# EAGLE design motor_driver_irf7413 (EAGLE 6.5.0)
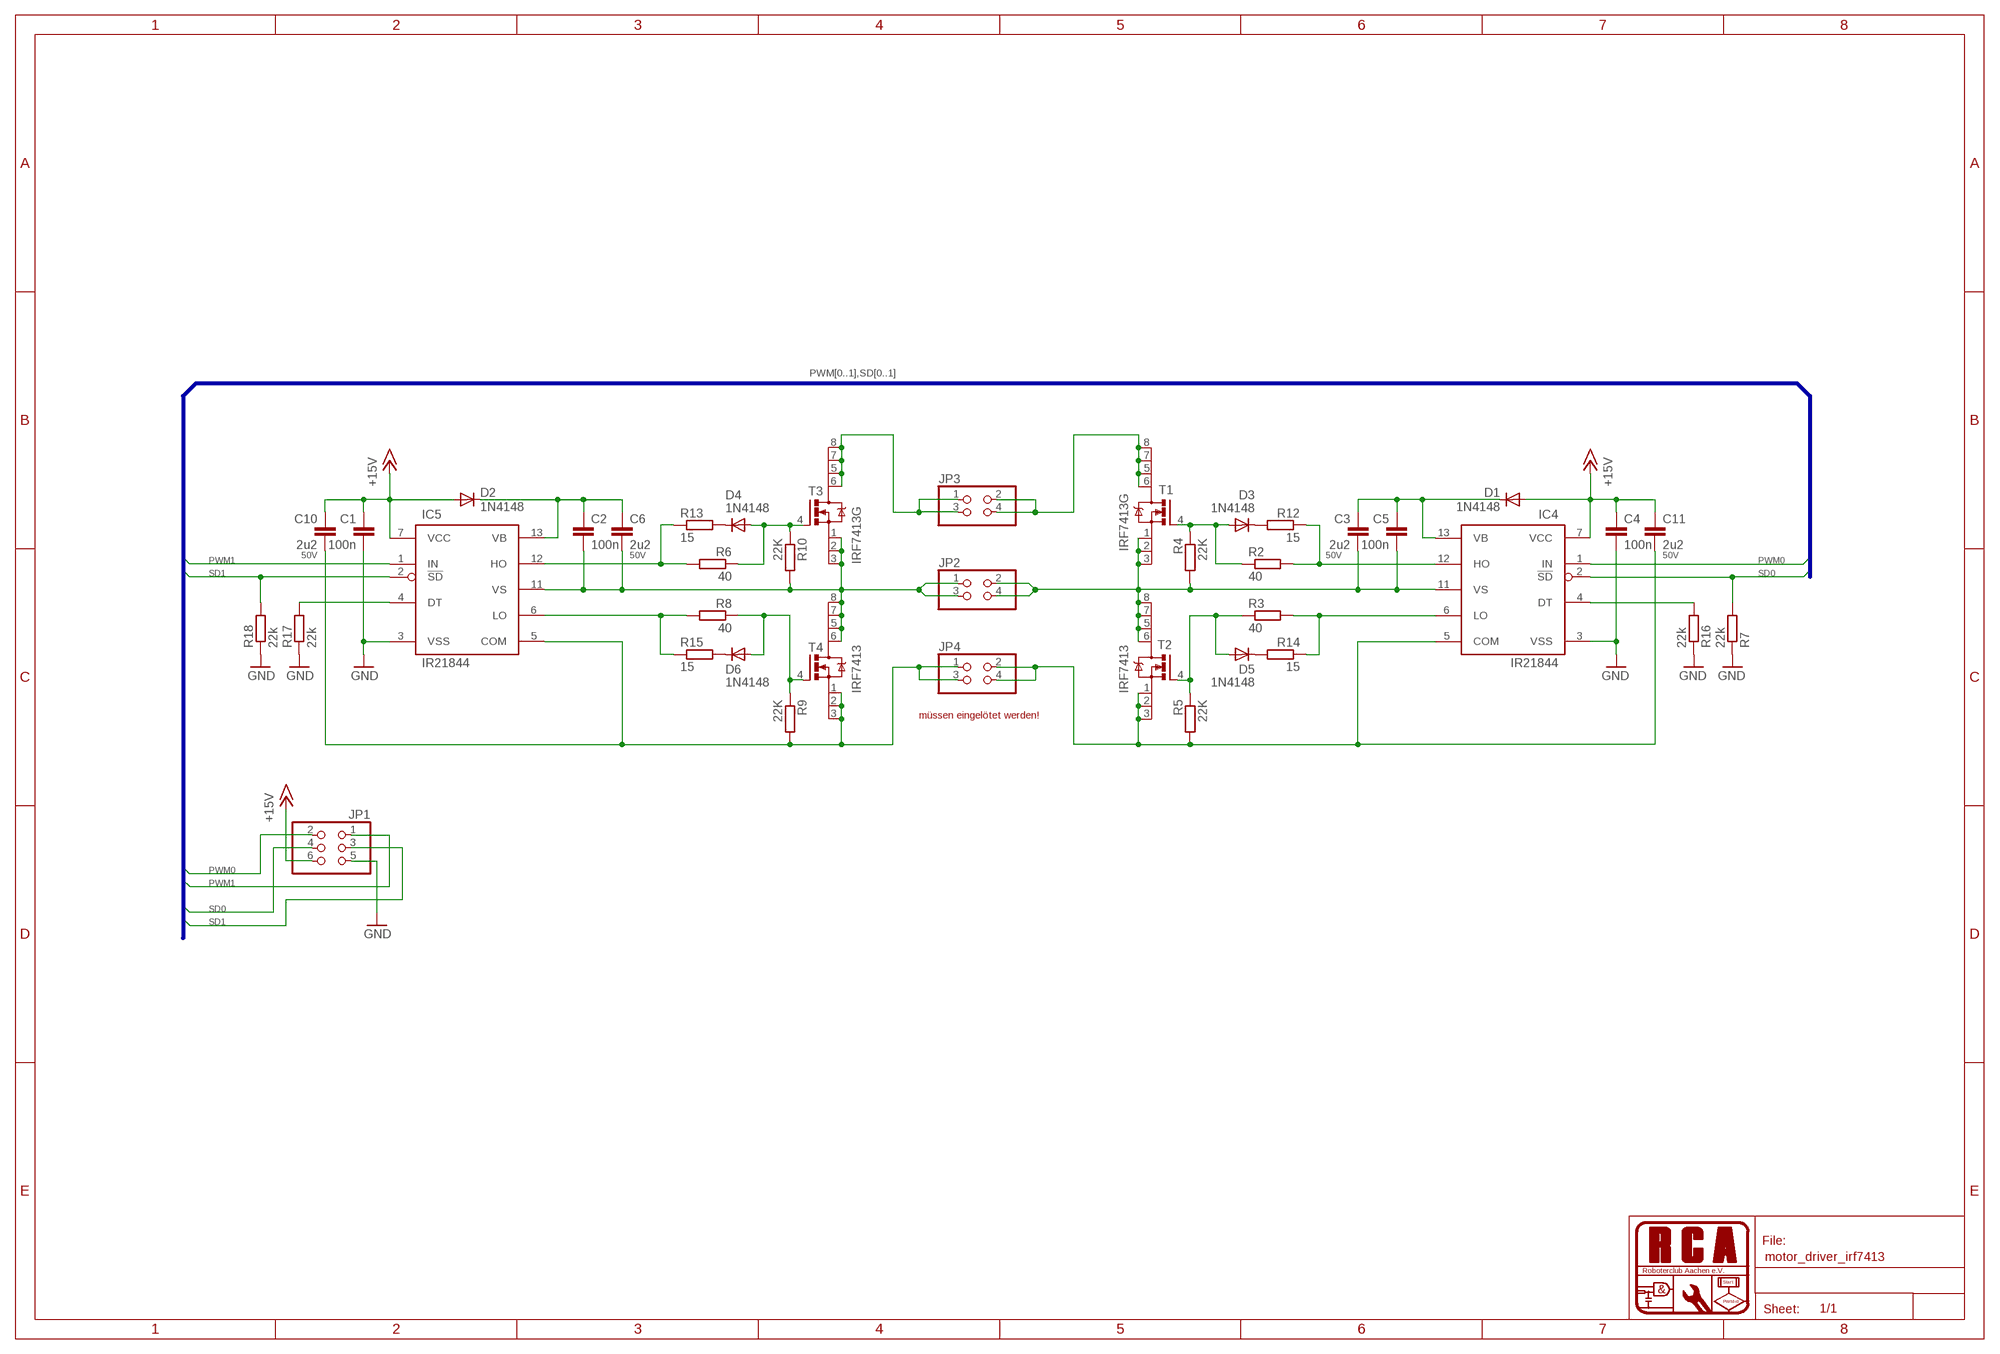
[diagram p0: schematic, sheet 1]

## Parts
C1  100n  C-EUC0805  [C0805]
C2  100n  C-EUC1206  [C1206]
C3  2u2  C-EUC1206  [C1206]
C4  100n  C-EUC0805  [C0805]
C5  100n  C-EUC1206  [C1206]
C6  2u2  C-EUC1206  [C1206]
C10  2u2  C-EUC1206  [C1206]
C11  2u2  C-EUC1206  [C1206]
D1  1N4148  DIODE-SOD80C  [SOD80C]
D2  1N4148  DIODE-SOD80C  [SOD80C]
D3  1N4148  DIODE-SOD80C  [SOD80C]
D4  1N4148  DIODE-SOD80C  [SOD80C]
D5  1N4148  DIODE-SOD80C  [SOD80C]
D6  1N4148  DIODE-SOD80C  [SOD80C]
IC4  IR21844  [SO14]
IC5  IR21844  [SO14]
JP1  PINHD-2X3_2.54-SIDE  [2X03_SIDE]
JP2  PINHD-2X2_2.54-SIDE  [2X02_SIDE]
JP3  PINHD-2X2_2.54-SIDE  [2X02_SIDE]
JP4  PINHD-2X2_2.54-SIDE  [2X02_SIDE]
R2  40  R-EU_M0805  [M0805]
R3  40  R-EU_M0805  [M0805]
R4  22K  R-EU_M0805  [M0805]
R5  22K  R-EU_M0805  [M0805]
R6  40  R-EU_M0805  [M0805]
R7  22k  R-EU_M0805  [M0805]
R8  40  R-EU_M0805  [M0805]
R9  22K  R-EU_M0805  [M0805]
R10  22K  R-EU_M0805  [M0805]
R12  15  R-EU_M0805  [M0805]
R13  15  R-EU_M0805  [M0805]
R14  15  R-EU_M0805  [M0805]
R15  15  R-EU_M0805  [M0805]
R16  22k  R-EU_M0805  [M0805]
R17  22k  R-EU_M0805  [M0805]
R18  22k  R-EU_M0805  [M0805]
T1  IRF7413G  [SO08G]
T2  IRF7413  [SO08]
T3  IRF7413G  [SO08G]
T4  IRF7413  [SO08]

## Nets
+15V: C1.1 C4.1 C10.1 C11.1 D1.A D2.A IC4.7(VCC) IC5.7(VCC) JP1.6
DT0: IC4.4(DT) R16.2
DT1: IC5.4(DT) R17.2
GND: C1.2 C4.2 IC4.3(VSS) IC5.3(VSS) JP1.5 R7.1 R16.1 R17.1 R18.1
N$2: C2.2 C6.2 IC5.11(VS) JP2.1 JP2.3 R10.2 T3.1(S) T3.2(S1) T3.3(S2) T4.5(D) T4.6(D1) T4.7(D2) T4.8(D3)
N$3: C3.2 C5.2 IC4.11(VS) JP2.2 JP2.4 R4.2 T1.1(S) T1.2(S1) T1.3(S2) T2.5(D) T2.6(D1) T2.7(D2) T2.8(D3)
N$4 [power]: D3.A R2.1 R4.1 T1.4(G)
N$5 [power]: D4.A R6.1 R10.1 T3.4(G)
N$6 [power]: IC4.12(HO) R2.2 R12.1
N$8 [power]: IC5.12(HO) R6.2 R13.1
N$9 [power]: IC5.6(LO) R8.2 R15.1
N$10: C2.1 C6.1 D2.C IC5.13(VB)
N$12: D3.C R12.2
N$13: D6.A R8.1 R9.1 T4.4(G)
N$14: D4.C R13.2
N$15 [power]: IC4.6(LO) R3.2 R14.1
N$16 [power]: D5.A R3.1 R5.1 T2.4(G)
N$17: JP3.1 JP3.3 T3.5(D) T3.6(D1) T3.7(D2) T3.8(D3)
N$18: D5.C R14.2
N$19: D6.C R15.2
N$21: JP3.2 JP3.4 T1.5(D) T1.6(D1) T1.7(D2) T1.8(D3)
N$22: C10.2 IC5.5(COM) JP4.1 JP4.3 R9.2 T4.1(S) T4.2(S1) T4.3(S2)
N$23: C11.2 IC4.5(COM) JP4.2 JP4.4 R5.2 T2.1(S) T2.2(S1) T2.3(S2)
N$39: C3.1 C5.1 D1.C IC4.13(VB)
PWM0: IC4.1(IN) JP1.2
PWM1: IC5.1(IN) JP1.1
SD0: IC4.2(!SD) JP1.4 R7.2
SD1: IC5.2(!SD) JP1.3 R18.2

## Buses
PWM[0..1],SD[0..1]

## Notes on the sheet
- müssen eingelötet werden!

## Library data of the parts
C1 C2 C4 C5 = rcl:C-EU: CAPACITOR, European symbol
C3 C6 C10 C11 = rcl:C-EU: CAPACITOR, European symbol; VOLTAGE: 50V
D1-D6 = diode:DIODE-: DIODE
IC4 IC5 = rca_mosfet:IR21844: IR21844 half-bridge driver Features Floating channel designed for bootstrap operation Fully operational to +600V Tolerant to negative transient voltage dV/dt immune Gate drive supply range from 10 to 20V Undervoltage lockout for both channels 3.3V and 5V input logic compatible Matched propagation delay for both channels Lower di/dt gate driver for better noise immunity Output source/sink current capability 1.4A/1.8A Description The IR2184(4)(S) are high voltage, high speed power MOSFET and IGBT drivers with dependent high and low side referenced output channels. Proprietary HVIC and latch immune CMOS technologies enable ruggedized monolithic construction. The logic input is compatible with standard CMOS or LSTTL output, down to 3.3V logic. The output drivers feature a high pulse current buffer stage designed for minimum driver cross-conduction. The floating channel can be used to drive an N-channel power MOSFET or IGBT in the high side configuration which operates up to 600 volts.
JP1 = pinhead2:PINHD-2X3: PIN HEADER
JP2-JP4 = pinhead2:PINHD-2X2: PIN HEADER
R2-R10 R12-R18 = rcl:R-EU_: RESISTOR, European symbol
T1-T4 = rca_mosfet:IRF7413: IRF7413 N-Channel RDS(on) = 0.011? VDSS = 30V

## Net classes
1 power: width 0.406 mm, drill 0.508 mm

## Board
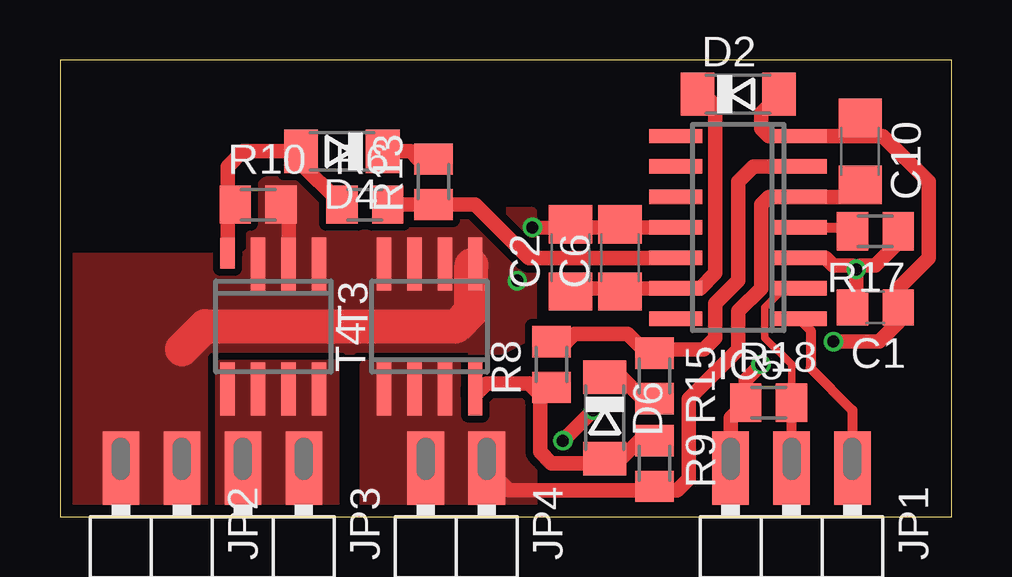
[diagram p1: board, top side]
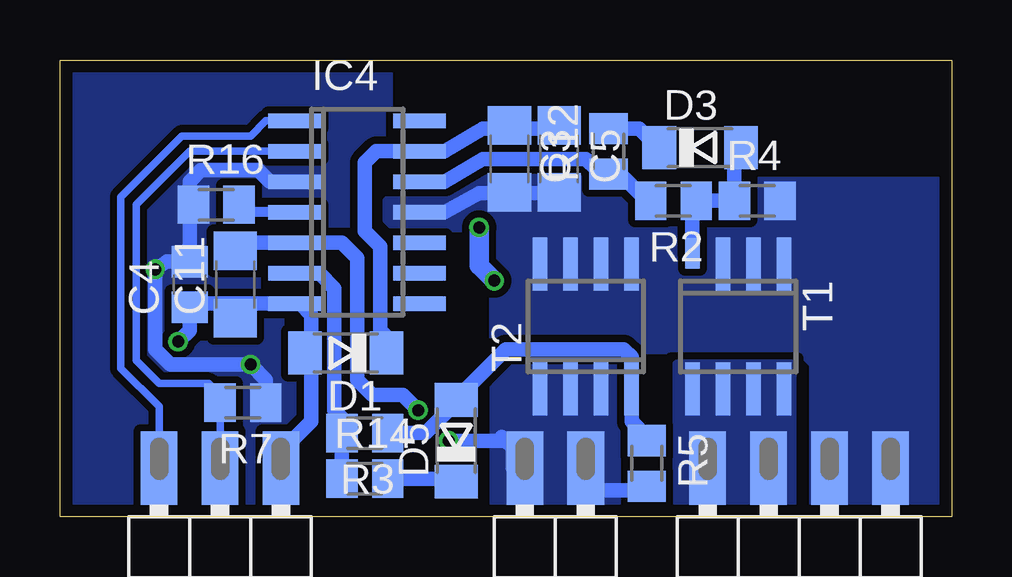
[diagram p2: board, bottom side, seen from below]

Size 37.15 x 19.05 mm. Coordinates in mm from the lower left corner, seen from the top.
Outline: 0,19.05 0,0 37.15,0 37.15,19.05 0,19.05
Copper layers (1*16): Top 0.035mm / dielectric 1.5mm / Bottom 0.035mm
Design rules "PCB-POOL": minimum track width 6mil, minimum drill 12mil, track to track 6mil, track to pad 6mil, pad to pad 6mil, via to via 6mil, smd to smd 6mil, copper to edge 20mil, drill to drill 8mil, minimum pad ring 8mil, minimum via ring 6mil, stop-mask expansion 3mil, vias tented up to drill 20mil, thermal gap 8mil

### Footprints (pad centres in the part's own frame; a part is rotated, then mirrored left to right if it is on the bottom)
C0805 = smd 1.3 x 1.5: 1 -0.95,0; 2 0.95,0
C1206 = smd 1.6 x 1.8: 1 -1.4,0; 2 1.4,0
SOD80C = smd 1.4 x 1.8: A 1.7,0; C -1.7,0
SO14 = smd 0.6 x 2.2: 1 -3.81,-2.6; 2 -2.54,-2.6; 3 -1.27,-2.6; 4 0,-2.6; 5 1.27,-2.6; 6 2.54,-2.6; 7 3.81,-2.6; 8 3.81,2.6; 9 2.54,2.6; 10 1.27,2.6; 11 0,2.6; 12 -1.27,2.6; 13 -2.54,2.6; 14 -3.81,2.6
2X03_SIDE = smd 1.524 x 3.048: 1 -2.54,-2.032; 3 0,-2.032; 5 2.54,-2.032 | smd 1.524 x 3.048 bottom: 2 -2.54,-2.032; 4 0,-2.032; 6 2.54,-2.032
2X02_SIDE = smd 1.524 x 3.048: 1 -1.27,-2.032; 3 1.27,-2.032 | smd 1.524 x 3.048 bottom: 2 -1.27,-2.032; 4 1.27,-2.032
M0805 = smd 1.3 x 1.6: 1 -0.95,0; 2 0.95,0
SO08G = smd 0.6 x 2.2: 1 -1.905,-2.6; 2 -0.635,-2.6; 3 0.635,-2.6; 5 1.905,2.6; 6 0.635,2.6; 7 -0.635,2.6; 8 -1.905,2.6 | smd 0.6 x 1.27: 4 1.905,-3.048
SO08 = smd 0.6 x 2.2: 1 -1.905,-2.6; 2 -0.635,-2.6; 3 0.635,-2.6; 4 1.905,-2.6; 5 1.905,2.6; 6 0.635,2.6; 7 -0.635,2.6; 8 -1.905,2.6

### Placement (x,y rotation side)
C1  33.97,8.73 180 top
C2  21.27,10.79 90 top
C3  18.41,14.92 270 bottom
C4  31.75,9.68 90 bottom
C5  16.35,14.92 270 bottom
C6  23.34,10.79 90 top
C10  33.34,15.24 270 top
C11  29.84,9.68 90 bottom
D1  25.24,6.83 180 bottom
D2  28.26,17.62 0 top
D3  10.48,15.4 0 bottom
D4  11.75,15.24 180 top
D5  20.64,3.17 90 bottom
D6  22.7,4.13 270 top
IC4  24.77,12.7 270 bottom
IC5  28.26,12.06 90 top
JP1  30.48,0 180 top
JP2  3.81,0 180 top
JP3  8.89,0 180 top
JP4  16.51,0 180 top
R2  11.59,13.18 180 bottom
R3  24.45,3.49 180 bottom
R4  8.1,13.18 0 bottom
R5  12.7,2.22 270 bottom
R6  12.7,13.02 0 top
R7  29.53,4.76 180 bottom
R8  20.48,6.35 90 top
R9  24.77,2.22 270 top
R10  8.26,13.02 0 top
R12  14.29,15.24 90 bottom
R13  15.56,13.97 90 top
R14  24.45,1.59 0 bottom
R15  24.77,5.87 270 top
R16  30.64,13.02 0 bottom
R17  33.97,11.91 180 top
R18  29.53,4.76 0 top
T1  8.89,7.94 180 bottom
T2  15.24,7.94 0 bottom
T3  8.89,7.94 180 top
T4  15.4,7.94 0 top

### Tracks (layer width: path | path; a pad name or v marks a point on that pad's centre or on a via)
+15V  (via drill 0.5)
  Top 0.61: D2.A 29.96,17.57 29.21,16.83 29.21,16.19 29.53,15.88 IC5.7 33.34,15.88 | v32.23,7.3 34.13,7.3 34.92,8.1 C1.1 | C1.1 | C1.1 34.92,9.53 36.2,10.79 36.2,13.97 34.29,15.88 33.34,15.88 | C10.1 33.34,15.88
  Bottom 0.61: 29.84,8.89 IC4.7 27.15,8.89 26.67,8.41 26.67,7.1 D1.A 26.83,6.83 26.67,6.99 26.67,3.97 27.94,2.7 JP1.6 | 29.84,8.89 31.59,8.89 C4.1 31.75,7.78 v32.23,7.3 | C11.1 29.84,8.89
DT0
  Bottom 0.406: IC4.4 29.37,12.7 R16.2
DT1
  Top 0.406: IC5.4 32.86,12.06 R17.2
GND  (via drill 0.5)
  Top 0.61: IC5.3 31.91,10.79 32.23,10.48 33.02,10.48 v33.18,10.32 | R17.1 34.92,11.74 34.77,11.27 33.97,10.48 33.34,10.48 v33.18,10.32 | JP1.5 27.94,4.12 R18.1 28.58,5.4 28.57,5.71 v29.21,6.35 | C1.2 33.18,8.89 v33.18,10.32
  Bottom 0.61: R18.1 28.58,5.4 28.57,5.71 v29.21,6.35 32.54,6.35 33.18,6.99 v33.18,10.32 32.7,10.64 C4.2 31.75,12.7 R16.1 31.75,13.18 31.75,13.97 31.27,14.45 28.89,14.45 28.42,13.97 IC4.3
  pour Bottom (isolate 0.305, rank 6, no thermals): 37.47,-0.64 37.47,19.68 23.5,19.68 23.5,-0.64
N$2  (via drill 0.5)
  Top 0.61: T3.2 9.53,12.7 R10.2 | IC5.11 23.31,12.06 C6.2 23.05,12.06 20.95,12.06 C2.2 | C2.2 20.95,12.22 | v19.68,12.06 21.27,12.04 C2.2
  Top 1.422: 5.08,6.99 6.03,7.94 16.51,7.94 17.14,8.57 17.14,10.48
  Bottom 0.813: v19.05,9.84 19.68,10.48 v19.68,12.06
  pour Top (isolate 0.305, rank 2, no thermals): -0.64,-1.27 6.03,-1.27 6.03,6.67 6.35,6.99 18.41,6.99 19.68,7.62 19.68,12.7 11.43,12.7 10.16,13.97 8.57,13.97 8.26,13.65 8.26,12.06 7.94,11.75 7.94,11.11 7.62,10.79 -0.64,10.79
N$3
  Bottom 0.61: IC4.11 21.11,12.7 19.68,13.49 18.76,13.49 C3.2 18.41,13.49 16.38,13.49 C5.2
  pour Bottom (isolate 0.305, rank 4, no thermals): 5.71,-0.64 5.71,6.35 6.35,6.99 19.05,6.99 19.05,12.06 23.18,12.06 23.5,12.38 23.5,13.18 23.18,13.49 21.43,13.49 20.48,14.45 14.45,14.45 12.7,12.7 10.16,12.7 8.89,13.97 -0.64,13.97 -0.64,-0.64
N$4
  Bottom 0.61: D3.A 8.78,15.35 9.05,15.08 R4.1 R2.1 10.79,13.02 T1.4
N$5
  Top 0.61: T3.4 6.99,12.7 R10.1 7.3,13.45 7.1,13.45 6.99,13.34 6.99,14.61 7.62,15.24 9.84,15.24 9.84,14.92 | R6.1 9.84,14.92 | 9.84,14.92 D4.A
N$6
  Bottom 0.61: IC4.12 21.11,13.97 19.53,14.92 15.24,14.92 14.76,14.45 14.29,14.45 | 14.29,14.45 R12.1 | 14.29,14.45 14.29,14.61 R12.1 | R12.1 14.29,13.97 | R2.2 12.7,13.18 13.81,14.29 R12.1
N$8
  Top 0.61: R6.2 R13.1 | R13.1 | R13.1 17.3,13.02 19.53,10.79 IC5.12
N$9
  Top 0.61: R8.2 20.8,6.99 21.43,7.62 23.65,7.62 24.77,6.51 24.76,6.51 R15.1 25.4,6.99 26.83,6.99 27.3,7.46 27.3,8.89 28.26,9.84 28.26,13.97 28.89,14.61 IC5.6
N$10
  Top 0.61: D2.C 26.67,17.78 27.3,17.14 27.3,10.16 26.67,9.53 IC5.13 23.31,9.53 C6.1 23.18,9.53 21.09,9.53 C2.1
N$12
  Bottom 0.61: R12.2 13.02,16.19 12.22,15.4 D3.C
N$13
  Top 0.61: T4.4 17.3,5.08 17.78,5.56 19.53,5.56 20,5.08 20.16,5.08 | R8.1 20.16,5.08 | 20.16,5.08 20,4.92 20,2.7 20.48,2.22 22.5,2.22 D6.A 23.38,2.43 24.13,3.17 R9.1
N$14
  Top 0.61: D4.C 14.61,15.24 14.92,14.92 R13.2
N$15
  Bottom 0.61: R14.1 R3.2 | R3.2 25.4,3.81 | 25.4,3.81 R3.2 | IC4.6 26.35,10.16 25.72,9.53 25.72,4.45 25.4,4.13 25.4,3.81
N$16
  Bottom 0.61: R3.1 21.91,3.49 20.84,4.56 D5.A 20.64,4.92 18.57,6.99 13.65,6.99 13.34,6.67 T2.4 13.34,3.97 12.7,3.33 R5.1
N$17
  pour Top (isolate 0.305, no thermals): 6.67,6.35 11.43,6.35 11.43,-0.95 6.67,-0.95
N$18
  Bottom 0.61: R14.2 20.84,1.59 D5.C
N$19
  Top 0.61: R15.2 24.29,4.92 23.34,5.87 22.75,5.87 D6.C
N$21
  pour Bottom (isolate 0.305, no thermals): 6.67,6.35 11.43,6.35 11.43,-0.32 6.67,-0.64
N$22
  Top 0.61: C10.2 33.34,13.34 IC5.5 29.53,13.34 29.21,13.02 29.21,9.53 28.26,8.57 28.26,6.99 26.19,4.92 26.19,1.59 25.72,1.11 24.93,1.11 R9.2 24.61,1.27 24.45,1.11 18.7,1.11 JP4.1
  pour Top (isolate 0.305, no thermals): 12.7,6.35 19.68,6.35 19.68,-0.95 12.7,-0.95
N$23  (via drill 0.5)
  Top 0.61: v22.23,4.45 v20.95,3.17
  Bottom 0.61: JP4.2 18.29,2.03 18.29,2.89 18.57,3.17 | R5.2 12.86,1.11 13.02,1.11 14.61,1.11 | C11.2 29.5,11.43 IC4.5 25.4,11.43 24.77,10.79 24.77,5.71 24.13,5.08 22.86,5.08 v22.23,4.45 | 18.57,3.17 18.73,3.33 | v20.95,3.17 18.57,3.17
  pour Bottom (isolate 0.305, no thermals): 13.97,6.35 19.05,6.35 19.05,-1.59 13.97,-0.32
N$39
  Bottom 0.61: D1.C 23.38,7.35 23.81,7.78 23.81,11.27 24.45,11.91 24.45,14.76 23.97,15.24 IC4.13 21.11,15.24 19.53,16.19 18.55,16.19 C3.1 18.41,16.19 16.48,16.19 C5.1
PWM0
  Bottom 0.305: IC4.1 28.57,16.51 29.21,15.88 32.07,15.88 34.61,13.34 34.61,6.19 33.02,4.6 JP1.2
PWM1
  Top 0.406: IC5.1 30.8,8.26 31.27,7.78 31.27,6.19 33.02,4.45 JP1.1
SD0
  Bottom 0.305: JP1.4 R7.2 30.48,5.08 30.96,5.56 33.02,5.56 33.97,6.51 33.97,13.02 31.75,15.24 IC4.2
SD1
  Top 0.305: R18.2 30.48,4.45 30.48,6.35 29.37,7.46 29.37,8.73 30.16,9.53 IC5.2
  Top 0.406: JP1.3 30.48,4.45 R18.2